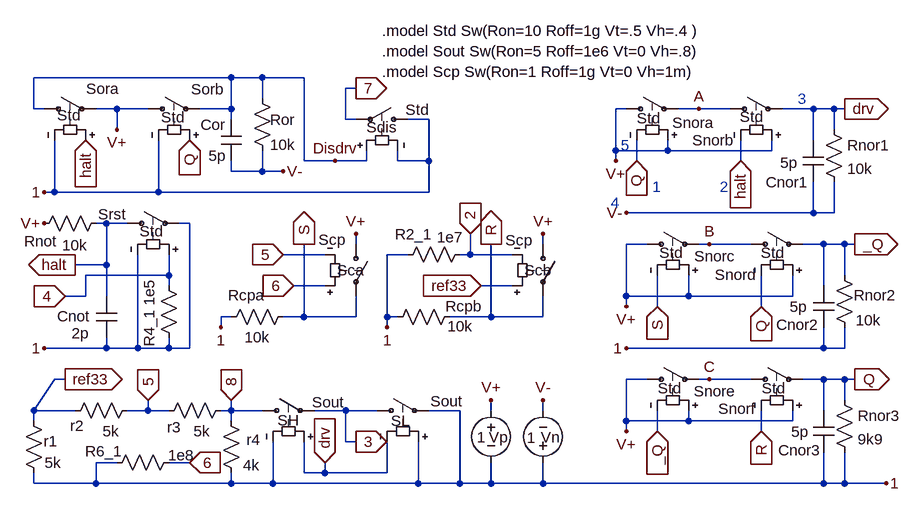
[diagram p0: schematic 555Sw.asc]
555Sw.asc, the LTspice schematic file:
Version 4
SHEET 1 1112 796
WIRE -288 0 -592 0
WIRE -240 0 -288 0
WIRE -176 0 -240 0
WIRE -96 16 -112 16
WIRE -240 32 -240 0
WIRE -592 48 -592 0
WIRE -576 48 -592 48
WIRE -464 48 -496 48
WIRE -416 48 -464 48
WIRE -288 48 -288 0
WIRE -288 48 -336 48
WIRE 320 48 304 48
WIRE 432 48 400 48
WIRE 480 48 432 48
WIRE 608 48 560 48
WIRE 640 48 608 48
WIRE 656 48 640 48
WIRE -288 64 -288 48
WIRE -112 64 -112 16
WIRE -96 64 -112 64
WIRE 16 64 -16 64
WIRE -464 80 -464 48
WIRE 640 80 640 48
WIRE 608 96 608 48
WIRE 304 112 304 48
WIRE 384 112 384 96
WIRE 384 112 304 112
WIRE 544 112 544 96
WIRE 544 112 384 112
WIRE -176 128 -176 0
WIRE -128 128 -176 128
WIRE -80 128 -80 112
WIRE -80 128 -128 128
WIRE -32 128 -32 112
WIRE 16 128 16 64
WIRE 16 128 -32 128
WIRE 304 128 304 112
WIRE 336 128 336 96
WIRE 496 128 496 96
WIRE -288 144 -288 128
WIRE -240 144 -240 112
WIRE -240 144 -288 144
WIRE -208 144 -240 144
WIRE -560 176 -560 96
WIRE -560 176 -576 176
WIRE -400 176 -400 96
WIRE -400 176 -560 176
WIRE 16 176 16 128
WIRE 16 176 -400 176
WIRE 608 208 608 160
WIRE 608 208 320 208
WIRE 640 208 640 160
WIRE 640 208 608 208
WIRE -480 224 -496 224
WIRE -448 224 -480 224
WIRE -352 224 -368 224
WIRE -96 256 -96 240
WIRE 192 256 192 240
WIRE 352 256 320 256
WIRE 448 256 432 256
WIRE 512 256 448 256
WIRE 624 256 592 256
WIRE 656 256 624 256
WIRE 672 256 656 256
WIRE -144 272 -208 272
WIRE -16 272 -48 272
WIRE 80 272 80 240
WIRE 80 272 64 272
WIRE 144 272 80 272
WIRE -480 288 -480 224
WIRE -480 288 -528 288
WIRE -384 304 -384 272
WIRE -384 304 -512 304
WIRE 656 304 656 256
WIRE -384 320 -384 304
WIRE -144 320 -192 320
WIRE 144 320 96 320
WIRE 624 320 624 256
WIRE -512 336 -512 304
WIRE -512 336 -544 336
WIRE -480 336 -480 288
WIRE 320 336 320 256
WIRE 416 336 416 304
WIRE 416 336 320 336
WIRE 576 336 576 304
WIRE 576 336 416 336
WIRE 320 352 320 336
WIRE 368 352 368 304
WIRE 528 352 528 304
WIRE -288 368 -304 368
WIRE -176 368 -176 256
WIRE -176 368 -208 368
WIRE -96 368 -96 336
WIRE -96 368 -176 368
WIRE -48 368 -48 272
WIRE -32 368 -48 368
WIRE 112 368 112 256
WIRE 112 368 48 368
WIRE 192 368 192 336
WIRE 192 368 112 368
WIRE -304 384 -304 368
WIRE -48 384 -48 368
WIRE -480 416 -480 400
WIRE -480 416 -576 416
WIRE -432 416 -432 272
WIRE -432 416 -480 416
WIRE -384 416 -384 400
WIRE -384 416 -432 416
WIRE -352 416 -352 224
WIRE -352 416 -384 416
WIRE 624 416 624 384
WIRE 624 416 320 416
WIRE 656 416 656 384
WIRE 656 416 624 416
WIRE -544 464 -560 464
WIRE 352 464 320 464
WIRE 448 464 432 464
WIRE 512 464 448 464
WIRE 624 464 592 464
WIRE 656 464 624 464
WIRE 672 464 656 464
WIRE 656 496 656 464
WIRE -592 512 -560 464
WIRE -528 512 -592 512
WIRE -416 512 -416 496
WIRE -416 512 -448 512
WIRE -384 512 -416 512
WIRE -288 512 -288 496
WIRE -288 512 -304 512
WIRE -240 512 -288 512
WIRE -112 512 -160 512
WIRE -64 512 -112 512
WIRE 64 512 16 512
WIRE 112 512 112 496
WIRE 192 512 192 496
WIRE 624 512 624 464
WIRE -592 528 -592 512
WIRE -288 528 -288 512
WIRE 320 528 320 464
WIRE 416 528 416 512
WIRE 416 528 320 528
WIRE 576 528 576 512
WIRE 576 528 416 528
WIRE 320 544 320 528
WIRE 368 544 368 512
WIRE 528 544 528 512
WIRE -112 560 -112 512
WIRE -96 560 -112 560
WIRE -464 592 -496 592
WIRE -352 592 -384 592
WIRE -176 608 -176 560
WIRE -144 608 -144 592
WIRE -144 608 -176 608
WIRE -48 608 -48 560
WIRE -48 608 -144 608
WIRE -592 624 -592 608
WIRE -496 624 -496 592
WIRE -496 624 -592 624
WIRE -288 624 -288 608
WIRE -288 624 -496 624
WIRE -224 624 -224 560
WIRE -224 624 -288 624
WIRE 0 624 0 560
WIRE 0 624 -224 624
WIRE 64 624 64 512
WIRE 64 624 0 624
WIRE 112 624 112 592
WIRE 112 624 64 624
WIRE 192 624 192 592
WIRE 192 624 112 624
WIRE 624 624 624 576
WIRE 624 624 192 624
WIRE 656 624 656 576
WIRE 656 624 624 624
WIRE 720 624 656 624
FLAG -544 464 ref33
IOPIN -544 464 Out
FLAG -416 496 5
IOPIN -416 496 In
FLAG -96 16 7
IOPIN -96 16 Out
FLAG -128 128 Disdrv
FLAG -288 496 8
IOPIN -288 496 In
FLAG -96 560 3
IOPIN -96 560 Out
FLAG -144 592 drv
IOPIN -144 592 In
FLAG 720 624 1
FLAG -352 592 6
IOPIN -352 592 In
FLAG 192 496 V-
FLAG 112 496 V+
FLAG -192 320 6
IOPIN -192 320 In
FLAG -208 272 5
IOPIN -208 272 In
FLAG -176 256 S
IOPIN -176 256 Out
FLAG -96 240 V+
FLAG 96 320 ref33
IOPIN 96 320 In
FLAG 80 240 2
IOPIN 80 240 In
FLAG 112 256 R
IOPIN 112 256 Out
FLAG 192 240 V+
FLAG -528 288 halt
IOPIN -528 288 Out
FLAG -544 336 4
IOPIN -544 336 In
FLAG -576 416 1
FLAG -576 224 V+
FLAG 656 48 drv
IOPIN 656 48 Out
FLAG 336 128 Q
IOPIN 336 128 In
FLAG 496 128 halt
IOPIN 496 128 In
FLAG 320 208 V-
FLAG 304 128 V+
FLAG 672 256 _Q
IOPIN 672 256 Out
FLAG 368 352 S
IOPIN 368 352 In
FLAG 528 352 Q
IOPIN 528 352 In
FLAG 320 416 1
FLAG 320 352 V+
FLAG 672 464 Q
IOPIN 672 464 Out
FLAG 368 544 _Q
IOPIN 368 544 In
FLAG 528 544 R
IOPIN 528 544 In
FLAG 320 544 V+
FLAG -512 96 halt
IOPIN -512 96 In
FLAG -352 96 Q
IOPIN -352 96 In
FLAG -208 144 V-
FLAG -464 80 V+
FLAG 432 48 A
FLAG 448 256 B
FLAG 448 464 C
FLAG -304 384 1
FLAG -48 384 1
FLAG -576 176 1
SYMBOL res -608 512 R0
WINDOW 0 31 47 Left 2
WINDOW 3 33 80 Left 2
SYMATTR InstName r1
SYMATTR Value 5k
SYMBOL res -432 496 R90
WINDOW 0 55 93 VBottom 2
WINDOW 3 32 41 VTop 2
SYMATTR InstName r2
SYMATTR Value 5k
SYMBOL res -288 496 R90
WINDOW 0 57 88 VBottom 2
WINDOW 3 32 45 VTop 2
SYMATTR InstName r3
SYMATTR Value 5k
SYMBOL sw 0 64 M270
WINDOW 0 -12 33 VRight 2
WINDOW 3 15 -16 VRight 2
SYMATTR InstName Sdis
SYMATTR Value Std
SYMBOL sw -256 512 R270
WINDOW 0 -15 39 VRight 2
WINDOW 3 13 92 VRight 2
SYMATTR InstName SH
SYMATTR Value Sout
SYMBOL sw -80 512 R270
WINDOW 0 -16 38 VRight 2
WINDOW 3 14 99 VRight 2
SYMATTR InstName SL
SYMATTR Value Sout
SYMBOL res -272 624 R180
WINDOW 0 -29 67 Left 2
WINDOW 3 -28 28 Left 2
SYMATTR InstName r4
SYMATTR Value 4k
SYMBOL voltage 112 496 R0
WINDOW 0 -3 57 Left 2
WINDOW 3 -22 57 Left 2
SYMATTR InstName Vp
SYMATTR Value 1
SYMBOL voltage 192 608 R180
WINDOW 0 -26 55 Left 2
WINDOW 3 11 54 Left 2
SYMATTR InstName Vn
SYMATTR Value 1
SYMBOL sw -96 240 R0
WINDOW 0 -29 56 Left 2
WINDOW 3 -58 9 Left 2
SYMATTR InstName Sca
SYMATTR Value Scp
SYMBOL res -368 576 R90
WINDOW 0 14 116 VBottom 2
WINDOW 3 -11 -3 VTop 2
SYMATTR InstName R6_1
SYMATTR Value 1e8
SYMBOL sw 192 240 R0
WINDOW 0 -29 56 Left 2
WINDOW 3 -58 10 Left 2
SYMATTR InstName Scb
SYMATTR Value Scp
SYMBOL res 80 256 R90
WINDOW 0 0 87 VBottom 2
WINDOW 3 -26 31 VTop 2
SYMATTR InstName R2_1
SYMATTR Value 1e7
SYMBOL sw -464 224 R270
WINDOW 0 14 -29 VRight 2
WINDOW 3 -12 35 VRight 2
SYMATTR InstName Srst
SYMATTR Value Std
SYMBOL res -480 208 R90
WINDOW 0 59 101 VBottom 2
WINDOW 3 34 49 VTop 2
SYMATTR InstName Rnot
SYMATTR Value 10k
SYMBOL sw 304 48 R270
WINDOW 0 -21 87 VRight 2
WINDOW 3 -14 32 VRight 2
SYMATTR InstName Snora
SYMATTR Value Std
SYMBOL sw 464 48 R270
WINDOW 0 -48 -42 VRight 2
WINDOW 3 -12 31 VRight 2
SYMATTR InstName Snorb
SYMATTR Value Std
SYMBOL sw 336 256 R270
WINDOW 0 -19 89 VRight 2
WINDOW 3 -13 35 VRight 2
SYMATTR InstName Snorc
SYMATTR Value Std
SYMBOL sw 496 256 R270
WINDOW 0 -47 -40 VRight 2
WINDOW 3 -13 31 VRight 2
SYMATTR InstName Snord
SYMATTR Value Std
SYMBOL sw 336 464 R270
WINDOW 0 -18 88 VRight 2
WINDOW 3 -14 33 VRight 2
SYMATTR InstName Snore
SYMATTR Value Std
SYMBOL sw 496 464 R270
WINDOW 0 -45 -34 VRight 2
WINDOW 3 -14 33 VRight 2
SYMATTR InstName Snorf
SYMATTR Value Std
SYMBOL sw -592 48 R270
WINDOW 0 31 81 VRight 2
WINDOW 3 -10 36 VRight 2
SYMATTR InstName Sora
SYMATTR Value Std
SYMBOL sw -432 48 R270
WINDOW 0 30 82 VRight 2
WINDOW 3 -13 36 VRight 2
SYMATTR InstName Sorb
SYMATTR Value Std
SYMBOL res -256 16 R0
WINDOW 0 28 49 Left 2
WINDOW 3 28 87 Left 2
SYMATTR InstName Ror
SYMATTR Value 10k
SYMBOL res 624 64 R0
SYMATTR InstName Rnor1
SYMATTR Value 10k
SYMBOL res 640 288 R0
WINDOW 0 30 47 Left 2
WINDOW 3 33 85 Left 2
SYMATTR InstName Rnor2
SYMATTR Value 10k
SYMBOL res 640 480 R0
SYMATTR InstName Rnor3
SYMATTR Value 9k9
SYMBOL cap -272 64 M0
SYMATTR InstName Cor
SYMATTR Value 5p
SYMBOL cap -464 336 M0
WINDOW 0 41 31 Left 2
WINDOW 3 43 57 Left 2
SYMATTR InstName Cnot
SYMATTR Value 2p
SYMBOL cap 624 96 M0
WINDOW 0 23 65 Left 2
WINDOW 3 40 35 Left 2
SYMATTR InstName Cnor1
SYMATTR Value 5p
SYMBOL cap 640 320 M0
WINDOW 0 23 60 Left 2
WINDOW 3 41 32 Left 2
SYMATTR InstName Cnor2
SYMATTR Value 5p
SYMBOL cap 640 512 M0
WINDOW 0 20 61 Left 2
WINDOW 3 39 33 Left 2
SYMATTR InstName Cnor3
SYMATTR Value 5p
SYMBOL res -400 304 R0
WINDOW 0 -14 52 VRight 2
WINDOW 3 -14 7 VRight 2
SYMATTR InstName R4_1
SYMATTR Value 1e5
SYMBOL res -192 352 R90
WINDOW 0 -2 73 VBottom 2
WINDOW 3 32 56 VTop 2
SYMATTR InstName Rcpa
SYMATTR Value 10k
SYMBOL res 64 352 R90
WINDOW 0 15 -6 VBottom 2
WINDOW 3 15 0 VTop 2
SYMATTR InstName Rcpb
SYMATTR Value 10k
TEXT 360 168 Left 2 ;1
TEXT 464 168 Left 2 ;2
TEXT 312 104 Left 2 ;5
TEXT 584 32 Left 2 ;3
TEXT 296 192 Left 2 ;4
TEXT -56 -72 Left 2 !.model Std Sw(Ron=10 Roff=1g Vt=.5 Vh=.4 )\n.model Sout Sw(Ron=5 Roff=1e6 Vt=0 Vh=.8)\n.model Scp Sw(Ron=1 Roff=1g Vt=0 Vh=1m)

The netlist it stands for:
* 555Sw.asc
r1 ref33 1 5k
r2 5 ref33 5k
r3 8 5 5k
Sdis 1 7 Disdrv 1 Std
SH 8 3 drv 1 Sout
SL 3 1 1 drv Sout
r4 1 8 4k
Vp V+ 1 1
Vn 1 V- 1
Sca V+ S 6 5 Scp
R6_1 6 1 1e8
Scb V+ R ref33 2 Scp
R2_1 2 1 1e7
Srst halt 1 4 1 Std
Rnot halt V+ 10k
Snora V+ A V+ Q Std
Snorb A drv V+ halt Std
Snorc V+ B V+ S Std
Snord B _Q V+ Q Std
Snore V+ C V+ _Q Std
Snorf C Q V+ R Std
Sora Disdrv V+ halt 1 Std
Sorb V+ Disdrv Q 1 Std
Ror Disdrv V- 10k
Rnor1 drv V- 10k
Rnor2 _Q 1 10k
Rnor3 Q 1 9k9
Cor Disdrv V- 5p
Cnot halt 1 2p
Cnor1 drv V- 5p
Cnor2 _Q 1 5p
Cnor3 Q 1 5p
R4_1 4 1 1e5
Rcpa S 1 10k
Rcpb R 1 10k
* 1
* 2
* 5
* 3
* 4
.model Std Sw(Ron=10 Roff=1g Vt=.5 Vh=.4 )
.model Sout Sw(Ron=5 Roff=1e6 Vt=0 Vh=.8)
.model Scp Sw(Ron=1 Roff=1g Vt=0 Vh=1m)
.backanno
.end